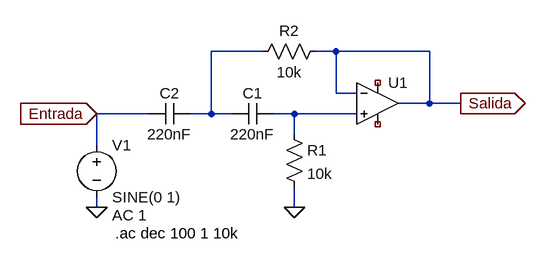
[diagram p0: schematic Filtro Sallen Key.asc]
Filtro Sallen Key.asc, the LTspice schematic file:
Version 4
SHEET 1 880 680
WIRE 64 64 -16 64
WIRE 176 64 144 64
WIRE 320 64 176 64
WIRE 176 128 176 64
WIRE 208 128 176 128
WIRE 320 144 320 64
WIRE 320 144 272 144
WIRE 368 144 320 144
WIRE -112 160 -192 160
WIRE -16 160 -16 64
WIRE -16 160 -48 160
WIRE 16 160 -16 160
WIRE 112 160 80 160
WIRE 208 160 112 160
WIRE 112 192 112 160
WIRE -192 208 -192 160
WIRE -192 304 -192 288
WIRE 112 304 112 272
FLAG 112 304 0
FLAG -192 304 0
FLAG 368 144 Salida
IOPIN 368 144 Out
FLAG -192 160 Entrada
IOPIN -192 160 In
SYMBOL OpAmps\\UniversalOpAmp 240 144 R0
SYMATTR InstName U1
SYMBOL res 96 176 R0
SYMATTR InstName R1
SYMATTR Value 10k
SYMBOL res 160 48 R90
WINDOW 0 0 56 VBottom 2
WINDOW 3 32 56 VTop 2
SYMATTR InstName R2
SYMATTR Value 10k
SYMBOL cap 80 144 R90
WINDOW 0 0 32 VBottom 2
WINDOW 3 32 32 VTop 2
SYMATTR InstName C1
SYMATTR Value 220nF
SYMBOL cap -48 144 R90
WINDOW 0 0 32 VBottom 2
WINDOW 3 32 32 VTop 2
SYMATTR InstName C2
SYMATTR Value 220nF
SYMBOL voltage -192 192 R0
WINDOW 123 24 124 Left 2
WINDOW 39 0 0 Left 0
SYMATTR InstName V1
SYMATTR Value SINE(0 1)
SYMATTR Value2 AC 1
TEXT -164 344 Left 2 !.ac dec 100 1 10k

The netlist it stands for:
* Filtro Sallen Key.asc
XU1 N002 Salida NC_01 NC_02 Salida level1 Avol=1Meg GBW=10Meg Vos=0 En=0 Enk=0 In=0 Ink=0 Rin=500Meg  ; pins In+ In- V+ V- OUT
R1 N002 0 10k
R2 Salida N001 10k
C1 N002 N001 220nF
C2 N001 Entrada 220nF
V1 Entrada 0 SINE(0 1) AC 1
.ac dec 100 1 10k
.lib UniversalOpAmp1.lib
.backanno
.end

* Results of the author's LTspice run, read from the files saved beside the schematic
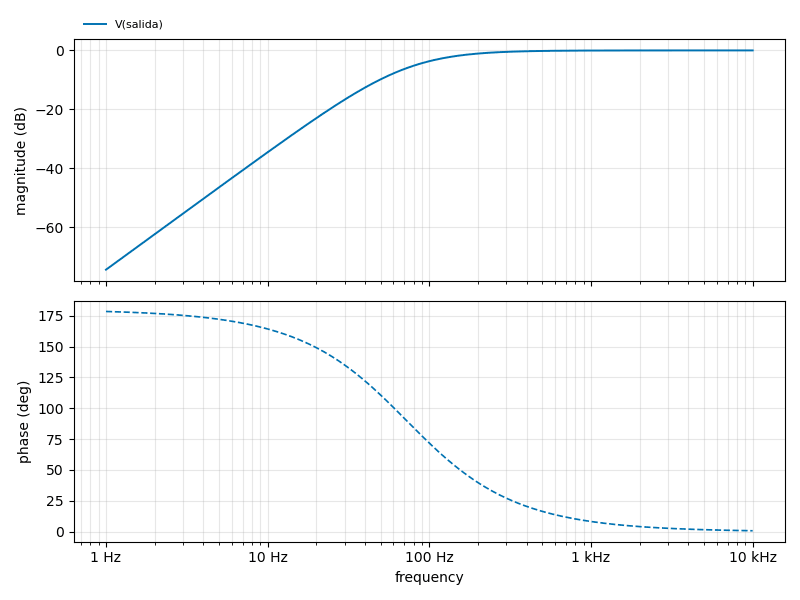
[diagram p1: AC Analysis of Filtro Sallen Key.asc, plotted from the saved traces]
* AC Analysis, 1 run:
*   V(salida): -74.38 dB at 1 Hz, -0.00 dB at 10 kHz, peak -0.00 dB at 10 kHz, 3 dB below the peak at 112.4 Hz